# Altium schematic sheet Booster_con.SchDoc: DisplayPort
size A3; Author: M.Beldyga; CompanyName: WUT ISE; DrawnBy: M.Beldyga; Organization: WUT ISE; Address1: PW ISE; Address2: Nowowiejska 15/19 00-665 Warsaw; Address3: micbeldyga@gmail.com; SheetNumber: 7; SheetTotal: 9; ModifiedBy: -; CheckedDate: -; Title2: Booster connector; DivGrp: WUT ISE; Designer: M.Beldyga; ModifiedDate: -; ProjectName: Sensor Box
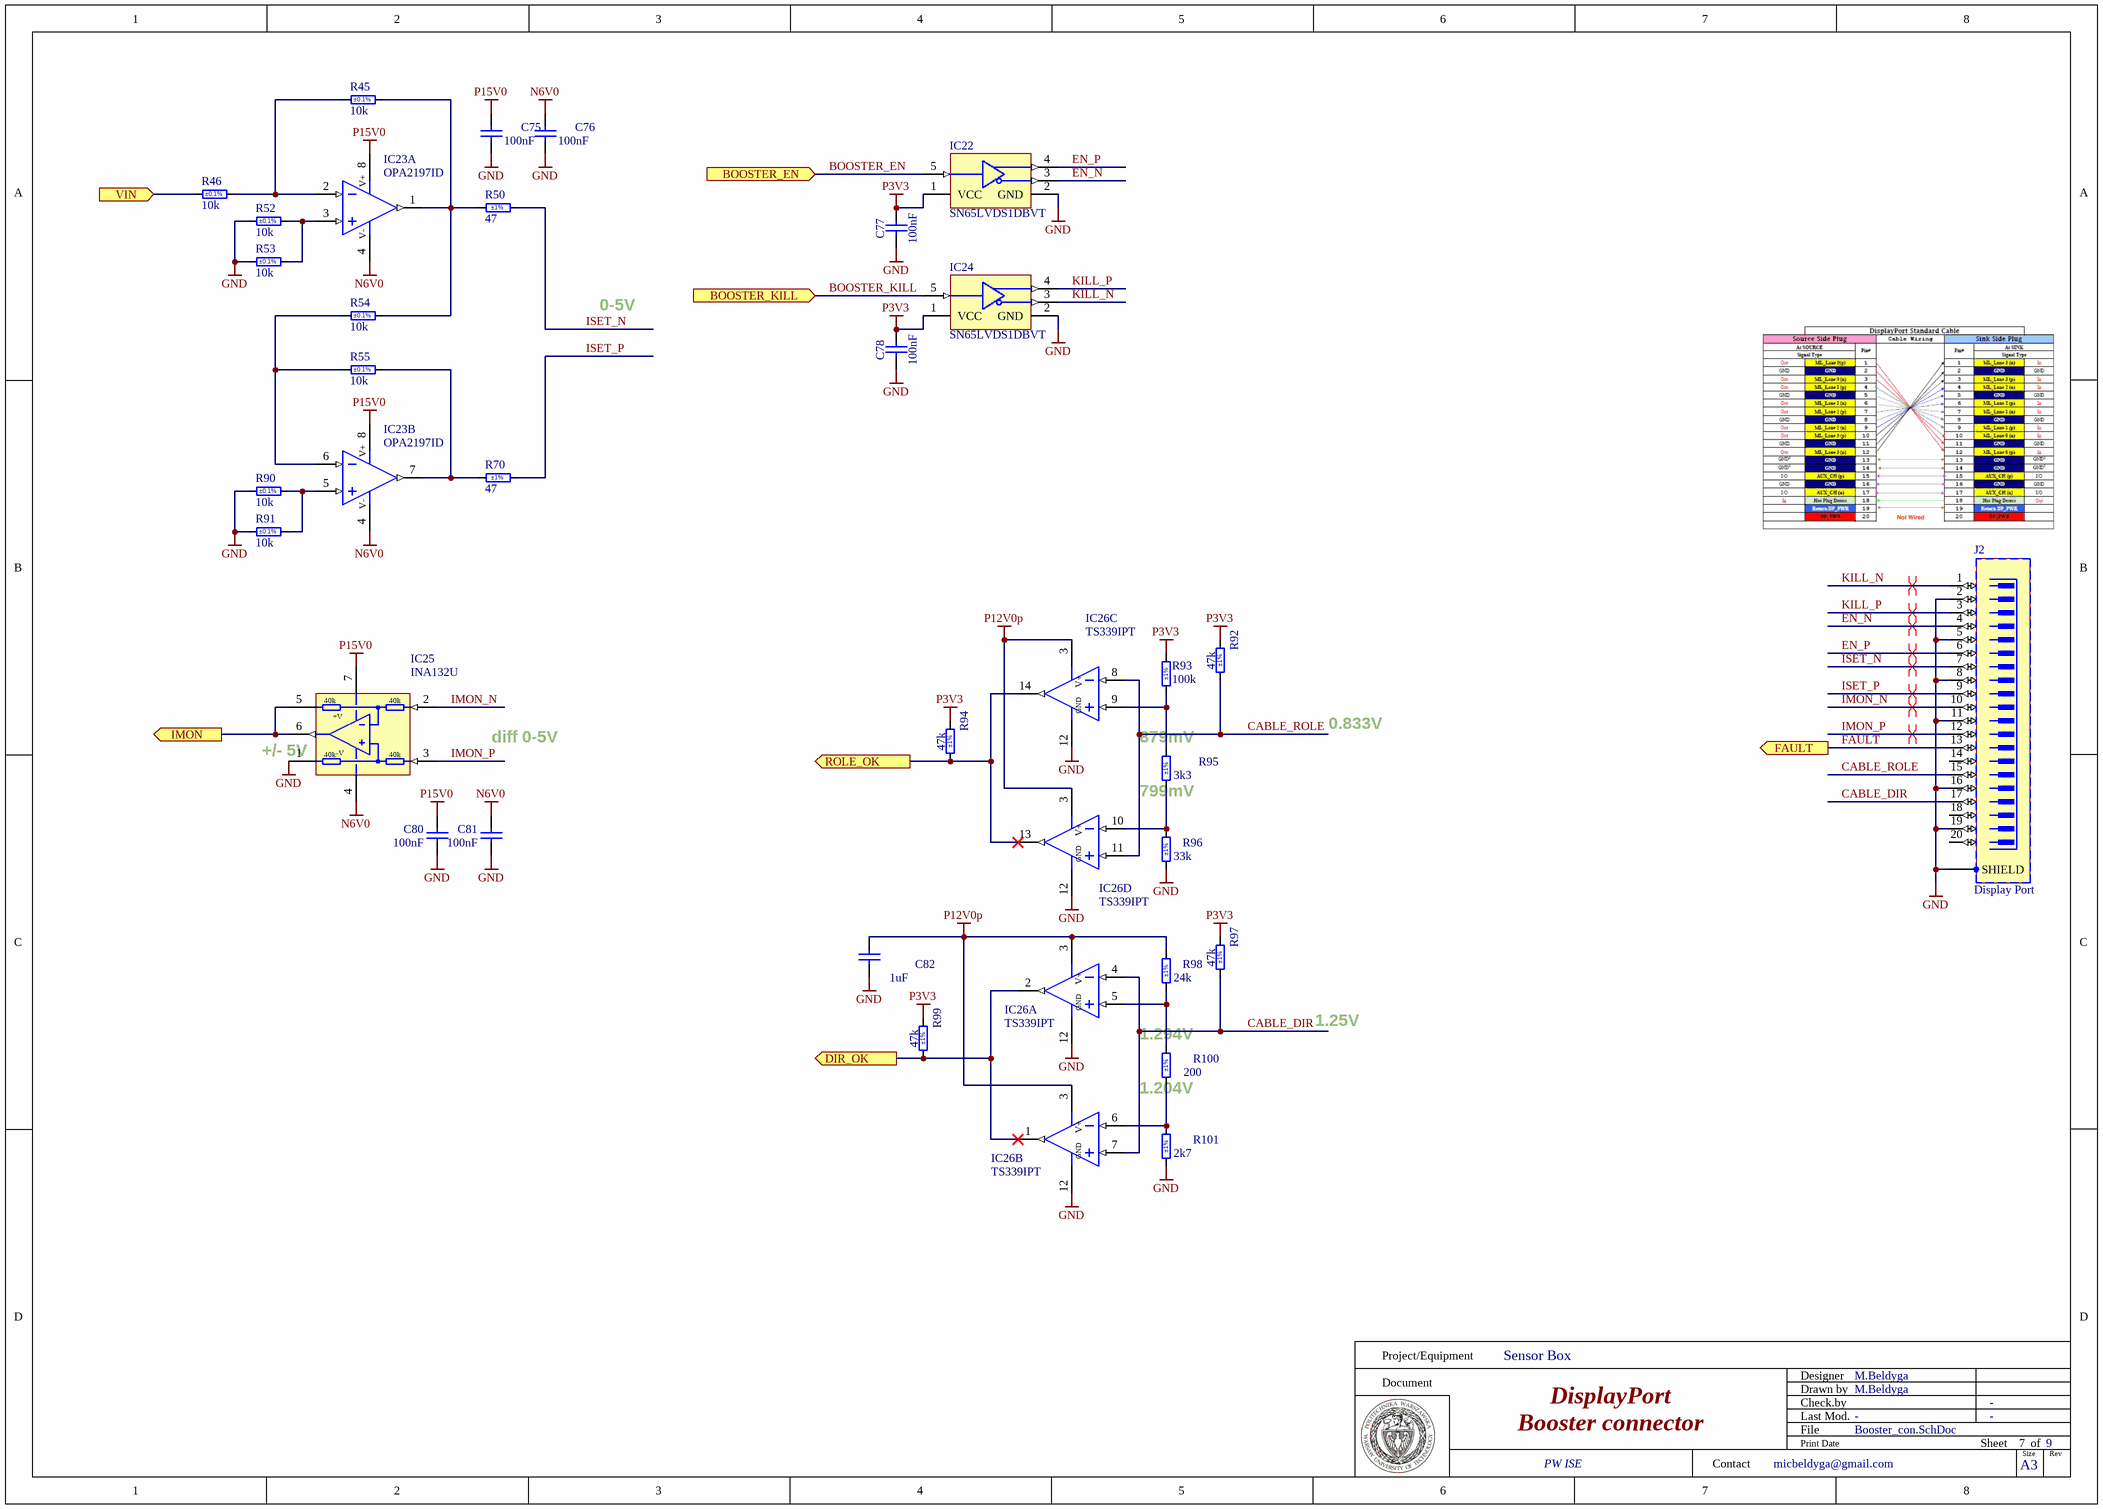
[diagram p0: Booster_con.SchDoc]

## Parts
C75  100nF  [CAPC1005X55N]
C76  100nF  [CAPC1005X55N]
C77  100nF  [CAPC1005X55N]
C78  100nF  [CAPC1005X55N]
C80  100nF  [CAPC1005X55N]
C81  100nF  [CAPC1005X55N]
C82  1uF  [CAPC1005X55N]
IC22  SN65LVDS1DBVT  [SOT95P280X145-5N]
IC23  OPA2197ID  [SOIC127P600X175-8N]  (parts A,B of 2)
IC24  SN65LVDS1DBVT  [SOT95P280X145-5N]
IC25  INA132U  [SOIC127P600X175-8N]
IC26  TS339IPT  [SOP65P640X120-14N]  (parts A,B,C,D of 4)
J2  Display Port  [MOLEX_47272-0001]
R45  10k  Tolerance: ±0.1%  [RESC1005X35N]
R46  10k  Tolerance: ±0.1%  [RESC1005X35N]
R50  47  Tolerance: ±1%  [RESC1005X40N]
R52  10k  Tolerance: ±0.1%  [RESC1005X35N]
R53  10k  Tolerance: ±0.1%  [RESC1005X35N]
R54  10k  Tolerance: ±0.1%  [RESC1005X35N]
R55  10k  Tolerance: ±0.1%  [RESC1005X35N]
R70  47  Tolerance: ±1%  [RESC1005X40N]
R90  10k  Tolerance: ±0.1%  [RESC1005X35N]
R91  10k  Tolerance: ±0.1%  [RESC1005X35N]
R92  47k  Tolerance: ±1%  [RESC1005X40N]
R93  100k  Tolerance: ±1%  [RESC1005X40N]
R94  47k  Tolerance: ±1%  [RESC1005X40N]
R95  3k3  Tolerance: ±1%  [RESC1005X40N]
R96  33k  Tolerance: ±1%  [RESC1005X40N]
R97  47k  Tolerance: ±1%  [RESC1005X40N]
R98  24k  Tolerance: ±1%  [RESC1005X40N]
R99  47k  Tolerance: ±1%  [RESC1005X40N]
R100  200  Tolerance: ±1%  [RESC1608X55N]
R101  2k7  Tolerance: ±1%  [RESC1005X40N]

## Ports
BOOSTER_EN (in), BOOSTER_KILL (in), DIR_OK (out), FAULT (out), IMON (out), ROLE_OK (out), VIN (in)

## Nets
GND: C75.1 C76.1 C77.1 C78.1 C80.1 C81.1 C82.1 IC22.2(GND) IC24.2(GND) IC25.1(REF) IC26.12(GND) J2.2 J2.5 J2.8 J2.11 J2.16 J2.19 J2.SHIELD R52.1 R53.1 R90.1 R91.1 R96.1 R101.1
N6V0: C76.2 C81.2 IC23.4(V-) IC25.4(-VEE)
P3V3: C77.2 C78.2 IC22.1(VCC) IC24.1(VCC) R92.2 R93.2 R94.2 R97.2 R99.2
P12V0p: C82.2 IC26.3(V+) R98.2
P15V0: C75.2 C80.2 IC23.8(V+) IC25.7(+VCC)
BOOSTER_EN: IC22.5(R) ; port BOOSTER_EN
BOOSTER_KILL: IC24.5(R) ; port BOOSTER_KILL
CABLE_DIR: IC26.4(IN-) IC26.7(IN+) J2.17 R97.1
CABLE_ROLE: IC26.8(IN-) IC26.11(IN+) J2.15 R92.1
DIR_OK: IC26.1(OUT) IC26.2(OUT) R99.1 ; port DIR_OK
EN_N: IC22.3(A) J2.4
EN_P: IC22.4(B) J2.6
FAULT: J2.13 ; port FAULT
IMON: IC25.5(SENS) IC25.6(OUT) ; port IMON
IMON_N: IC25.2(IN-) J2.10
IMON_P: IC25.3(IN+) J2.12
ISET_N: J2.7 R50.2
ISET_P: J2.9 R70.2
KILL_N: IC24.3(A) J2.1
KILL_P: IC24.4(B) J2.3
ROLE_OK: IC26.13(OUT) IC26.14(OUT) R94.1 ; port ROLE_OK
VIN: R46.1 ; port VIN
NetIC23_1: IC23.1(OUT) R45.1 R50.1 R54.2
NetIC23_2: IC23.2(IN-) R45.2 R46.2
NetIC23_3: IC23.3(IN+) R52.2 R53.2
NetIC23_5: IC23.5(IN+) R90.2 R91.2
NetIC23_6: IC23.6(IN-) R54.1 R55.2
NetIC23_7: IC23.7(OUT) R55.1 R70.1
NetIC26_5: IC26.5(IN+) R98.1 R100.2
NetIC26_6: IC26.6(IN-) R100.1 R101.2
NetIC26_9: IC26.9(IN+) R93.1 R95.2
NetIC26_10: IC26.10(IN-) R95.1 R96.2

Not connected (* = marked no-connect by the designer): J2 14 18 20

## Layout directives
differential pair; net class Analog: IMON_N, IMON_P, ISET_N, ISET_P
differential pair; net class D100: EN_N, EN_P, KILL_N, KILL_P

## Notes on the sheet
- 0-5V
- +/- 5V
- (near IC25) diff 0-5V
- (near IC26) 879mV
- 0.833V
- (near IC26) 799mV
- (near IC26) 1.294V
- 1.25V
- (near IC26) 1.204V
- Project/Equipment
- Document
- Designer
- Drawn by
- Check.by
- Contact
- File
- Last Mod.
- Print Date
- Sheet
- Size
- A3
- of
- Rev
- (in symbol INA132U) 40k; +V; -V

## Library data of the parts
C75 C76 C80 C81 = CC0402_100NF_16V_10%_X5R: Non-polarised capacitor; Part Description: SMD Multilayer Chip Ceramic Capacitor; Manufacturer: GENERIC; Manufacturer1 Part Number: GRM155R61C104KA88D; Voltage: 16V; TC: X5R; Tolerance: ±10%; Part Number: CC0402_100NF_16V_10%_X5R; Component Kind: Standard; Component Type: Standard; Pin Count: 2; Value: 100nF; Status: None; Manufacturer Part Number: CC0402_100NF_16V_10%_X5R; Case: 0402; Mounted: Yes; Socket: No; SMD: Yes; Sense: No; Manufacturer1 Example: MURATA; Manufacturer1 ComponentHeight: 0.55mm; HelpURL: \\cern.ch\dfs\Applications\Altium\Datasheets\CC0402_X5R_MURATA_GRM.pdf; Author: CERN DEM JLC; CreateDate: 10.12.2013; LatestRevisionDate: 10.12.2013
C77 C78 = CC0402_100NF_16V_10%_X7R: Non-polarised capacitor; Part Description: SMD Multilayer Chip Ceramic Capacitor; Manufacturer: GENERIC; Manufacturer1 Part Number: GRM155R71C104KA88D; Voltage: 16V; TC: X7R; Tolerance: ±10%; Part Number: CC0402_100NF_16V_10%_X7R; Component Kind: Standard; Component Type: Standard; Pin Count: 2; Value: 100nF; Status: Not Recommended; Manufacturer Part Number: CC0402_100NF_16V_10%_X7R; Case: 0402; Mounted: Yes; Socket: No; SMD: Yes; Sense: No; Manufacturer1 Example: MURATA; Manufacturer1 ComponentHeight: 0.55mm; HelpURL: \\cern.ch\dfs\Applications\Altium\Datasheets\CC0402_X7R_MURATA_GRM.pdf; Author: CERN DEM JLC; CreateDate: 05.12.2013; LatestRevisionDate: 03.12.2007
C82 = CC0402_1UF_16V_10%_X5R: Non-polarised capacitor; Part Description: SMD Multilayer Chip Ceramic Capacitor; Manufacturer: GENERIC; Manufacturer1 Part Number: C1005X5R1C105KT; Voltage: 16V; TC: X5R; Tolerance: ±10%; Part Number: CC0402_1UF_16V_10%_X5R; Component Kind: Standard; Component Type: Standard; Pin Count: 2; Value: 1uF; Status: Preferred; Manufacturer Part Number: CC0402_1UF_16V_10%_X5R; Case: 0402; Mounted: Yes; Socket: No; SMD: Yes; Sense: No; Manufacturer1 Example: TDK; Manufacturer1 ComponentHeight: 0.55mm; HelpURL: \\cern.ch\dfs\Applications\Altium\Datasheets\CC0402_X5R_TDK_C.pdf; Author: CERN DEM JLC; CreateDate: 25.10.2012; LatestRevisionDate: 25.10.2012
IC22 IC24 = SN65LVDS1DBVT: High-Speed Differential Line Driver; Manufacturer: TEXAS INSTRUMENTS; PressFit: No; Bonding: No; Part Number: SN65LVDS1DBVT; Component Kind: Standard; Component Type: Standard; Device: SN65LVDS1DBVT; PackageDescription: SOT, 0.95mm Pitch; 5 Pin, 1.60mm W X 2.90mm L X 1.45mm H body, IPC Medium Density; Part Description: High-Speed Differential Line Driver; Manufacturer Part Number: SN65LVDS1DBV; Pin Count: 5; Case: SOT23-5; Mounted: Yes; Socket: No; SMD: Yes; Sense: No; ComponentHeight: 1.45mm; Author: CERN DEM JLC; HelpURL: \\cern.ch\dfs\Applications\Altium\Datasheets\SN65LVDS1DBVT.pdf; CreateDate: 9/22/2011; LatestRevisionDate: 6/10/2022
IC23 = OPA2197ID: Dual Operational Amplifier; Part Description: Dual, 36-V, Precision, Rail-to-Rail Input/Output, Low Offset Voltage, Operational Amplifiers; Manufacturer: TEXAS INSTRUMENTS; PressFit: No; Bonding: No; Part Number: OPA2197ID; Component Kind: Standard; Component Type: Standard; Device: OPA2197ID; PackageDescription: SOIC 8, Pitch 1.27mm - Body 4x5mm, IPC Medium Density; Manufacturer Part Number: OPA2197ID; Pin Count: 8; Case: SOIC8; Mounted: Yes; Socket: No; SMD: Yes; Sense: No; ComponentHeight: 1.75mm; Author: CERN DEM MR; HelpURL: \\cern.ch\dfs\Applications\Altium\Datasheets\OPA2197ID.pdf; CreateDate: 8/7/2019; LatestRevisionDate: 8/7/2019
IC25 = INA132U: High-Speed, Precision Difference Amplifier; Manufacturer: TEXAS INSTRUMENTS; PressFit: No; Bonding: No; Part Number: INA132U; Component Kind: Standard; Component Type: Standard; Device: INA132U; PackageDescription: SOIC 8, Pitch 1.27mm, Body 4x5mm, IPC Medium Density; Part Description: High-Speed, Precision Difference Amplifier; Manufacturer Part Number: INA132U; Pin Count: 7; Case: SOIC8; Mounted: Yes; Socket: No; SMD: Yes; Sense: No; ComponentHeight: 1.75mm; Author: CERN DEM JLC; HelpURL: \\cern.ch\dfs\Applications\Altium\Datasheets\INA132U.pdf; CreateDate: 3/11/2015; LatestRevisionDate: 3/11/2015
IC26 = CMP_TS339: Quad comparator; Part Description: Ultra-Low Power Quad Comparator; Manufacturer: ST; PressFit: No; Bonding: No; Part Number: TS339IPT; Component Kind: Standard; Component Type: Standard; Device: TS339IPT; PackageDescription: SOP, 14-Leads, Body 5.1x4.5mm (max), Pitch 0.65mm, IPC Medium Density; Manufacturer Part Number: TS339IPT; Pin Count: 14; Case: TSSOP14; Mounted: Yes; Socket: No; SMD: Yes; Sense: No; ComponentHeight: 1.75mm; Author: GK; HelpURL: \\cern.ch\dfs\Applications\Altium\Datasheets\LP339M-NOPB.pdf; CreateDate: 23.03.2016; LatestRevisionDate: 23.03.2016
J2 = MOLEX_47272-0001: Connector Mini DisplayPort 20 Male + 1 Shield; Part Description: 20 Circuits, 0.50mm Pitch, Right Angle DisplayPort Male Receptacle; Manufacturer: MOLEX; PressFit: No; Part Number: MOLEX_47272-0001; Component Kind: Standard; Component Type: Standard; Pin Count: 21; Family: Display Port; Mounted: Yes; Socket: No; SMD: Yes; Sense: No; Status: None; Manufacturer Part Number: 47272-0001; ComponentHeight: 5.63mm; HelpURL: \\cern.ch\dfs\Applications\Altium\Datasheets\MOLEX_47272-0001.pdf; Author: CERN DEM JLC; CreateDate: 2/5/2015; LatestRevisionDate: 2/5/2015
R45 R46 R52-R55 R90 R91 = R0402_10K_0.1%_0.063W_25PPM: Resistor - 0.1%; Part Description: Thin Film Precision Resistor; Manufacturer: GENERIC; Manufacturer1 Part Number: CPF0402B10KE1; Power: 0.063W; TC: ±25ppm/°C; PressFit: No; Part Number: R0402_10K_0.1%_0.063W_25PPM; Component Kind: Standard; Component Type: Standard; Pin Count: 2; Value: 10k; Status: Not Recommended; Manufacturer Part Number: R0402_10K_0.1%_0.063W_25PPM; Case: 0402; Mounted: Yes; Sense: No; Socket: No; SMD: Yes; Manufacturer1 Example: TE CONNECTIVITY; Manufacturer1 ComponentHeight: 0.35mm; HelpURL: \\cern.ch\dfs\Applications\Altium\Datasheets\R0402_TYCO_CPF.pdf; Author: CERN DEM JMW; CreateDate: 9/22/2015; LatestRevisionDate: 9/22/2015
R50 R70 = R0402_47R_1%_0.0625W_100PPM: Resistor - 1%; Part Description: General Purpose Thick Film Chip Resistor; Manufacturer: GENERIC; Manufacturer1 Part Number: 232270674709L; TC: ±100ppm/°C; PressFit: No; Part Number: R0402_47R_1%_0.0625W_100PPM; Component Kind: Standard; Component Type: Standard; Pin Count: 2; Value: 47; Status: Not Recommended; Power: 0.0625W; Manufacturer Part Number: R0402_47R_1%_0.0625W_100PPM; Case: 0402; Mounted: Yes; Sense: No; Socket: No; SMD: Yes; Manufacturer1 Example: YAGEO PHYCOMP; Manufacturer1 ComponentHeight: 0.4mm; HelpURL: \\cern.ch\dfs\Applications\Altium\Datasheets\R0402_Phycomp_RC0402.pdf; Author: CERN DEM JLC; CreateDate: 12/3/2007; LatestRevisionDate: 10/17/2012
R92 R94 R97 R99 = R0402_47K_1%_0.0625W_100PPM: Resistor - 1%; Part Description: General Purpose Thick Film Chip Resistor; Manufacturer: GENERIC; Manufacturer1 Part Number: 232270674703L; TC: ±100ppm/°C; PressFit: No; Part Number: R0402_47K_1%_0.0625W_100PPM; Component Kind: Standard; Component Type: Standard; Pin Count: 2; Value: 47k; Status: Not Recommended; Power: 0.0625W; Manufacturer Part Number: R0402_47K_1%_0.0625W_100PPM; Case: 0402; Mounted: Yes; Sense: No; Socket: No; SMD: Yes; Manufacturer1 Example: YAGEO PHYCOMP; Manufacturer1 ComponentHeight: 0.4mm; HelpURL: \\cern.ch\dfs\Applications\Altium\Datasheets\R0402_Phycomp_RC0402.pdf; Author: CERN DEM JLC; CreateDate: 03.12.2007; LatestRevisionDate: 17.10.2012
R93 = R0402_100K_1%_0.0625W_100PPM: Resistor - 1%; Part Description: General Purpose Thick Film Chip Resistor; Manufacturer: GENERIC; Manufacturer1 Part Number: 232270671004L; TC: ±100ppm/°C; PressFit: No; Part Number: R0402_100K_1%_0.0625W_100PPM; Component Kind: Standard; Component Type: Standard; Pin Count: 2; Value: 100k; Status: Not Recommended; Power: 0.0625W; Manufacturer Part Number: R0402_100K_1%_0.0625W_100PPM; Case: 0402; Mounted: Yes; Sense: No; Socket: No; SMD: Yes; Manufacturer1 Example: YAGEO PHYCOMP; Manufacturer1 ComponentHeight: 0.4mm; HelpURL: \\cern.ch\dfs\Applications\Altium\Datasheets\R0402_Phycomp_RC0402.pdf; Author: CERN DEM JLC; CreateDate: 12/3/2007; LatestRevisionDate: 10/17/2012
R95 = R0402_3K3_1%_0.0625W_100PPM: Resistor - 1%; Part Description: General Purpose Thick Film Chip Resistor; Manufacturer: GENERIC; Manufacturer1 Part Number: 232270673302L; TC: ±100ppm/°C; PressFit: No; Part Number: R0402_3K3_1%_0.0625W_100PPM; Component Kind: Standard; Component Type: Standard; Pin Count: 2; Value: 3k3; Status: Not Recommended; Power: 0.0625W; Manufacturer Part Number: R0402_3K3_1%_0.0625W_100PPM; Case: 0402; Mounted: Yes; Sense: No; Socket: No; SMD: Yes; Manufacturer1 Example: YAGEO PHYCOMP; Manufacturer1 ComponentHeight: 0.4mm; HelpURL: \\cern.ch\dfs\Applications\Altium\Datasheets\R0402_Phycomp_RC0402.pdf; Author: CERN DEM JLC; CreateDate: 03.12.2007; LatestRevisionDate: 17.10.2012
R96 = R0402_33K_1%_0.0625W_100PPM: Resistor - 1%; Part Description: General Purpose Thick Film Chip Resistor; Manufacturer: GENERIC; Manufacturer1 Part Number: 232270673303L; TC: ±100ppm/°C; PressFit: No; Part Number: R0402_33K_1%_0.0625W_100PPM; Component Kind: Standard; Component Type: Standard; Pin Count: 2; Value: 33k; Status: Not Recommended; Power: 0.0625W; Manufacturer Part Number: R0402_33K_1%_0.0625W_100PPM; Case: 0402; Mounted: Yes; Sense: No; Socket: No; SMD: Yes; Manufacturer1 ComponentHeight: 0.4mm; HelpURL: \\cern.ch\dfs\Applications\Altium\Datasheets\R0402_Phycomp_RC0402.pdf; Author: CERN DEM JLC; CreateDate: 12/3/2007; LatestRevisionDate: 10/17/2012; Manufacturer1 Example: YAGEO PHYCOMP
R98 = R0402_24K_1%_0.0625W_100PPM: Resistor - 1%; Part Description: General Purpose Thick Film Chip Resistor; Manufacturer: GENERIC; Manufacturer1 Part Number: 232270672403L; TC: ±100ppm/°C; PressFit: No; Part Number: R0402_24K_1%_0.0625W_100PPM; Component Kind: Standard; Component Type: Standard; Pin Count: 2; Value: 24k; Status: Not Recommended; Power: 0.0625W; Manufacturer Part Number: R0402_24K_1%_0.0625W_100PPM; Case: 0402; Mounted: Yes; Sense: No; Socket: No; SMD: Yes; Manufacturer1 Example: YAGEO PHYCOMP; Manufacturer1 ComponentHeight: 0.4mm; HelpURL: \\cern.ch\dfs\Applications\Altium\Datasheets\R0402_Phycomp_RC0402.pdf; Author: CERN DEM JLC; CreateDate: 03.12.2007; LatestRevisionDate: 17.10.2012
R100 = R0603_200R_1%_0.1W_100PPM: Resistor - 1%; Part Description: General Purpose Thick Film Chip Resistor; Manufacturer: GENERIC; Manufacturer1: Vishay; Manufacturer1 Part Number: CRCW0603200RFKEA; Power: 0.1W; TC: ±100ppm/°C; PressFit: No; Part Number: R0603_200R_1%_0.1W_100PPM; Component Kind: Standard; Component Type: Standard; Pin Count: 2; Value: 200; Status: Preferred; Manufacturer Part Number: R0603_200R_1%_0.1W_100PPM; Case: 0603; Mounted: Yes; Sense: No; Socket: No; SMD: Yes; Manufacturer1 ComponentHeight: 0.55mm; HelpURL: \\cern.ch\dfs\Applications\Altium\Datasheets\R0603_NIC_NRC.pdf; Author: CERN DEM JLC; CreateDate: 03.12.2007; LatestRevisionDate: 13.03.2008
R101 = R0402_2K7_1%_0.0625W_100PPM: Resistor - 1%; Part Description: General Purpose Thick Film Chip Resistor; Manufacturer: GENERIC; Manufacturer1 Part Number: RC0402FR-072K7L; TC: ±200ppm/°C; PressFit: No; Part Number: R0402_2K7_1%_0.0625W_100PPM; Component Kind: Standard; Component Type: Standard; Pin Count: 2; Value: 2k7; Status: Not Recommended; Power: 0.0625W; Manufacturer Part Number: R0402_2K7_1%_0.0625W_100PPM; Case: 0402; Mounted: Yes; Sense: No; Socket: No; SMD: Yes; Manufacturer1 ComponentHeight: 0.4mm; HelpURL: \\cern.ch\dfs\Applications\Altium\Datasheets\R0402_YAGEO_RC_L.pdf; Author: CERN DEM HF; CreateDate: 8/28/2024; LatestRevisionDate: 8/28/2024; Manufacturer1 Example: YAGEO PHYCOMP